# Altium schematic sheet Timer 555 _ LEVEL .SchDoc
size B; SheetNumber: 1; SheetTotal: 1; SPICEModelCacheTCHUTLJM: <root> / <DocumentId>TCHUTLJM</DocumentId> / <CacheFrame Number="0"> / <Model Name="2n3904" Kind="MDL"> / <Text>*2N3904 / *Si 310mW  40V 200mA 300MHz pkg:TO-92B 1,2,3 / .MODEL 2N3904 NPN(IS=1.4E-14 BF=300 VAF=100 IKF=0.025 ISE=3E-13 / + BR=7.5 RC=2.4 CJE=4.5E-12 TF=4E-10 CJC=3.5E-12 TR=2.1E-8 XTB=1.5 KF=9E-16 )</Text> / </Model> / </CacheFrame> / </root>
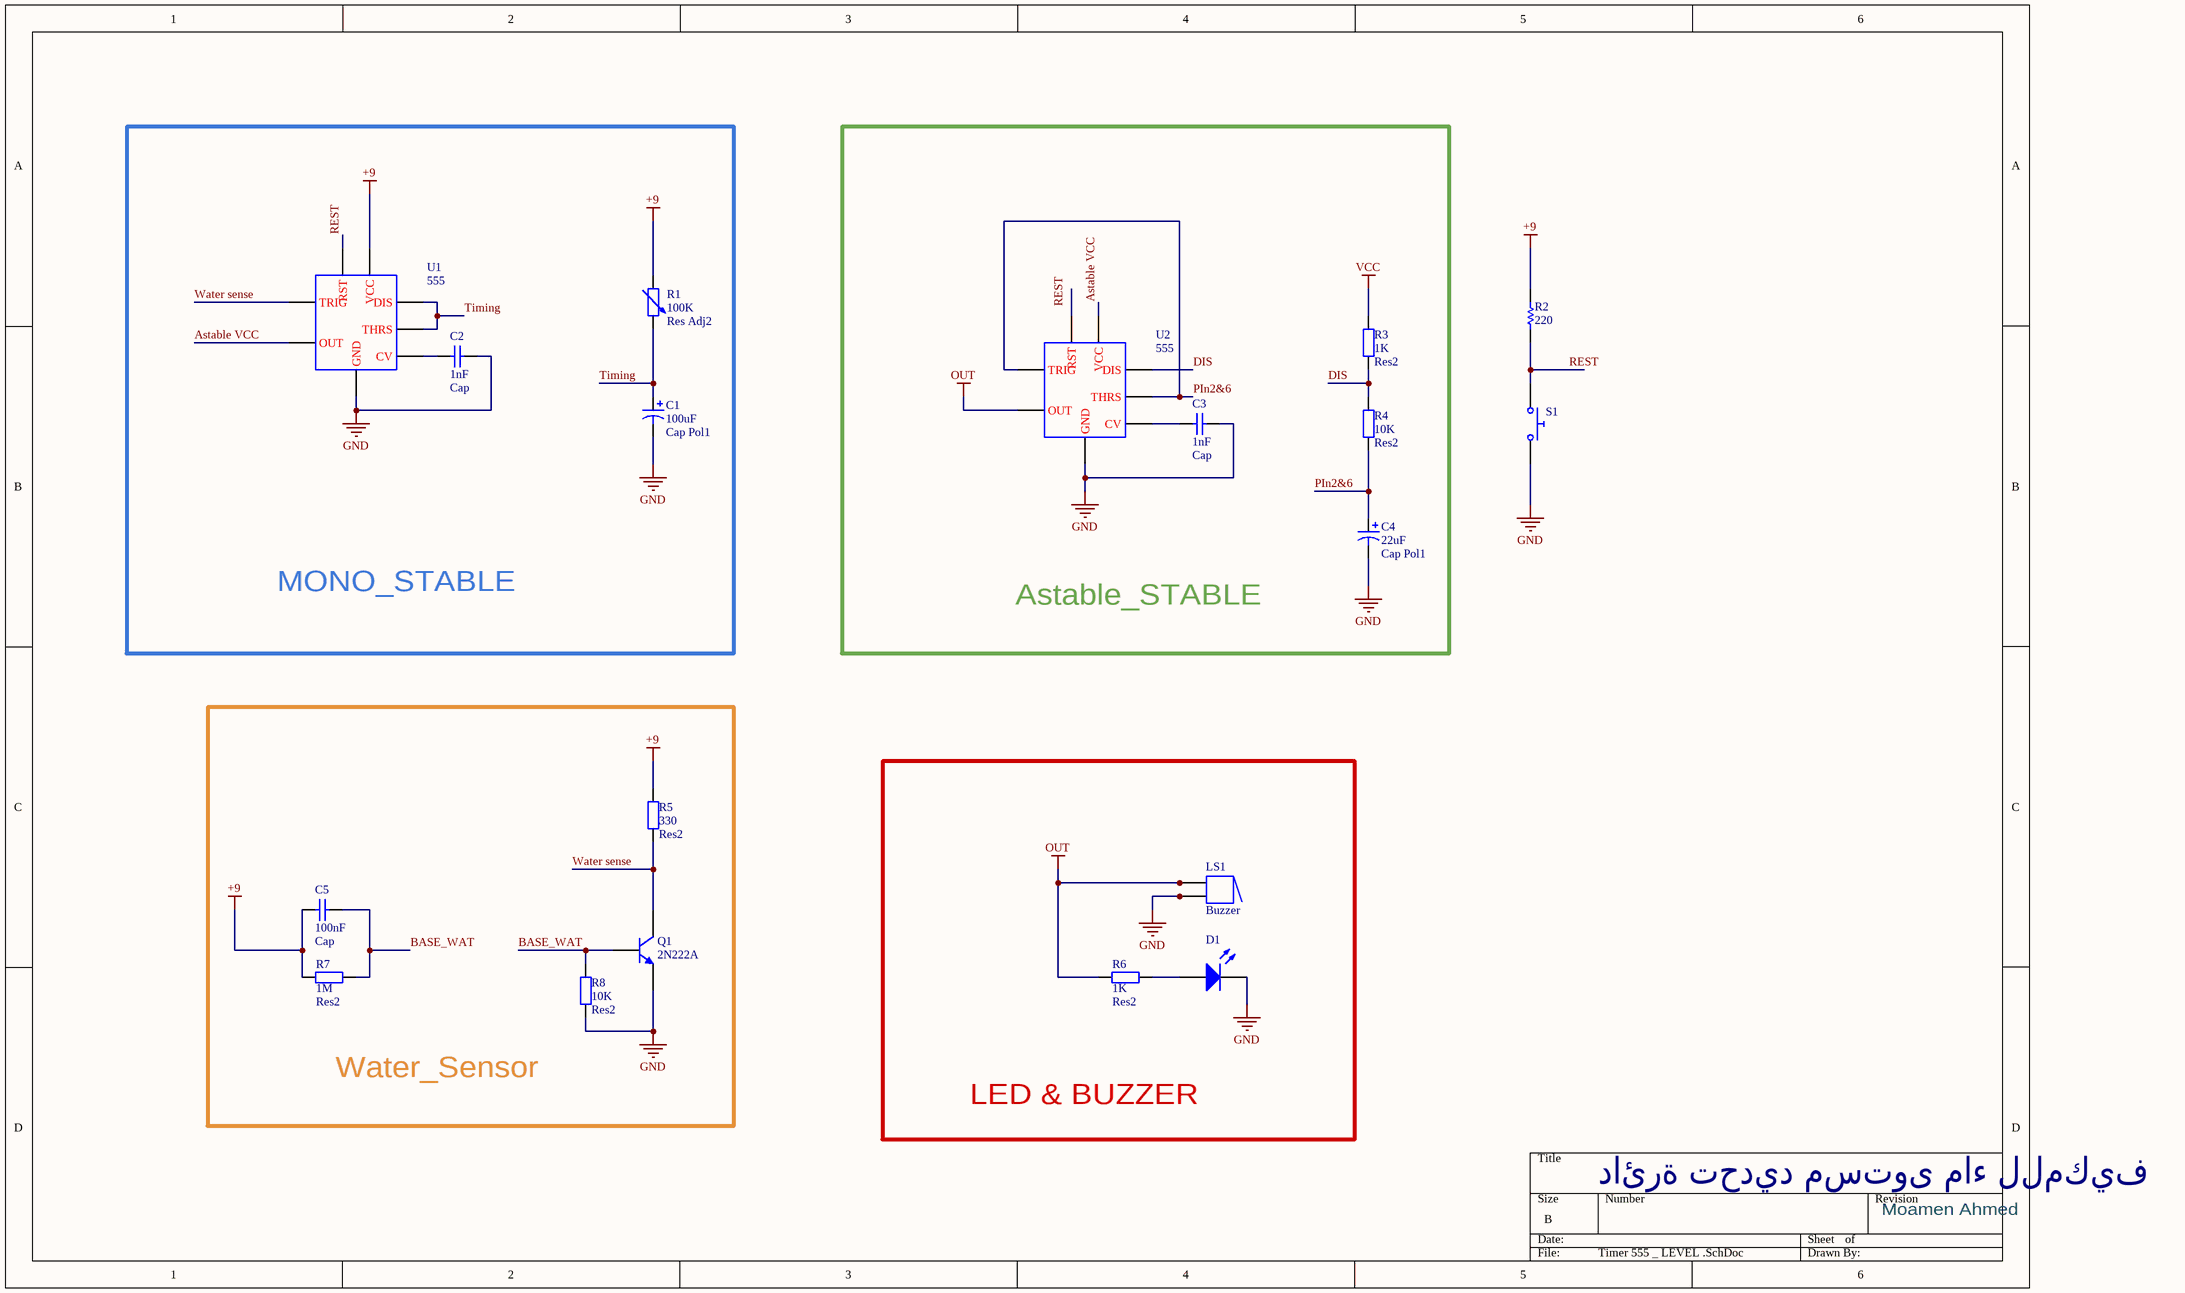
[diagram p0: Timer 555 _ LEVEL .SchDoc]

## Parts
C1  Cap Pol1  value 100uF  [RB7.6-15]
C2  Cap  value 1nF  [RAD-0.3]
C3  Cap  value 1nF  [RAD-0.3]
C4  Cap Pol1  value 22uF  [RB7.6-15]
C5  Cap  value 100nF  [RAD-0.3]
D1  Light-Emitting Diode  (value not drawn)
LS1  Buzzer  [ABSM-1574]
Q1  2N222A  [TO-92A]
R1  Res Adj2  value 100K  [AXIAL-0.6]
R2  value 220  (hidden comment: Resistor)
R3  Res2  value 1K  [AXIAL-0.4]
R4  Res2  value 10K  [AXIAL-0.4]
R5  Res2  value 330  [AXIAL-0.4]
R6  Res2  value 1K  [AXIAL-0.4]
R7  Res2  value 1M  [AXIAL-0.4]
R8  Res2  value 10K  [AXIAL-0.4]
S1  Push Button Normally Opened  (value not drawn)
U1  555
U2  555

## Blocks framed on the sheet
MONO_STABLE: C1 C2 R1 U1
Astable_STABLE: C3 C4 R3 R4 U2
Water_Sensor: C5 Q1 R5 R7 R8
LED & BUZZER: D1 LS1 R6

## Nets
+9: C5.1 R1.1 R2.2 R5.2 R7.2 U1.8(VCC)
GND: C1.2 C2.2 C3.2 C4.2 D1.2(K) LS1.2 LS1.2A Q1.1(E) R8.1 S1.2 U1.1(GND) U2.1(GND)
OUT: LS1.1 LS1.1A R6.2 U2.3(OUT)
VCC: R3.2
Astable VCC: U1.3(OUT) U2.8(VCC)
BASE_WAT: C5.2 Q1.2(B) R7.1 R8.2
DIS: R3.1 R4.2 U2.7(DIS)
PIn2&6: C4.1 R4.1 U2.2(TRIG) U2.6(THRS)
REST: R2.1 S1.1 U1.4(RST)
Timing: C1.1 R1.2 U1.6(THRS) U1.7(DIS)
Water sense: Q1.3(C) R5.1 U1.2(TRIG)
NetC2_1: C2.1 U1.5(CV)
NetC3_1: C3.1 U2.5(CV)
NetD1_1: D1.1(A) R6.1

Not connected (* = marked no-connect by the designer): U2 4(RST)

## Notes on the sheet
- دائرة تحديد مستوى ماء للمكيف
- Moamen Ahmed
- Labels drawn without touching a wire or pin: REST

## Library data of the parts
C1 C4 = Cap Pol1: Polarized Capacitor (Radial); Published: 8-Jun-2000; LatestRevisionDate: 17-Jul-2002; LatestRevisionNote: Re-released for DXP Platform.; PackageReference: RB7.6-15; Publisher: Altium Limited; PackageDescription: Polarized Capacitor (Radial); 2 Leads
C2 C3 C5 = Cap: Capacitor; Published: 8-Jun-2000; LatestRevisionDate: 17-Jul-2002; LatestRevisionNote: Re-released for DXP Platform.; PackageReference: RAD-0.3; Publisher: Altium Limited; PackageDescription: Radial Cap, Thru-Hole; 2 Leads; 0.3 in Pin Spacing
D1 = LED: AF: 1; BV: 0; BV_MAX: 1e99; EG: 1.11; FC: 0.5; IBV: 0.001; IS: 1e-14; MJSW: 0.33; NTUN: 30; TNOM: 27; XTI: 3; SimulationGenericComponent: True; CJO: 0; CJP: 0; CTA: 0; CTP: 0; FCS: 0.5; FV_MAX: 1e99; IKF: 0; IKR: 0; ISR: 1e-14; JSW: 0; JTUN: 0; JTUNSW: 0; KEG: 1; KF: 0; LEVEL: 1; N: 1; NBV: 1; NR: 1; NS: 1; PHP: 1; RS: 0; TCV: 0; TLEV: 0; TLEVC: 0; TM1: 0; TM2: 0; TPB: 0; TPHP: 0; TRS: 0; TRS2: 0; TT: 0; TTT1: 0; TTT2: 0; VJ: 1; XTITUN: 3
LS1 = Buzzer: Magnetic Transducer Buzzer; Published: 24-Mar-1999; LatestRevisionDate: 17-Dec-2003; LatestRevisionNote: Schematic revised, PCB Footprint replaced.; DatasheetVersion: 17-Dec-2003; PackageReference: ABSM-1574; Publisher: Altium Limited; PackageDescription: Magnetic Transducer Buzzer; ComponentLink1Description: Manufacturer Link; ComponentLink1URL: http://www.megastar.com/linecard/buzzmode/index.php
Q1 = 2N3904: NPN General Purpose Amplifier; Published: 8-Jun-2000; LatestRevisionDate: 15-Jan-2003; LatestRevisionNote: PCB Footprint 'BCY-W3/D4.7' replaced; DatasheetVersion: 1997; PackageVersion: Sep-1998; PackageReference: TO-92A; Publisher: Altium Limited; PackageDescription: TO, Flat Index; 3 In-Line, Axial Leads; Body Dia. 4.5mm; Leads 0.51 x 0.48 mm (max); ComponentLink1Description: Manufacturer Link; ComponentLink1URL: http://www.fairchildsemi.com/; ComponentLink2Description: Datasheet; ComponentLink2URL: http://www.fairchildsemi.com/ds/2N%2F2N3904.pdf
R1 = Res Adj2: Variable Resistor; Set Position: 0.5; Published: 8-Jun-2000; LatestRevisionDate: 17-Jul-2002; LatestRevisionNote: Re-released for DXP Platform.; PackageReference: AXIAL-0.6; Publisher: Altium Limited; PackageDescription: Axial Device, Thru-Hole; 2 Leads; 0.6 in Pin Spacing
R2 = Resistor: TC1: 0; SimulationGenericComponent: True; TC2: 0
R3-R8 = Res2: Resistor; Published: 8-Jun-2000; LatestRevisionDate: 17-Jul-2002; LatestRevisionNote: Re-released for DXP Platform.; PackageReference: AXIAL-0.4; Publisher: Altium Limited; PackageDescription: Axial Device, Thru-Hole; 2 Leads; 0.4 in Pin Spacing
S1 = Push Button NO: closed: 0; Rclosed: 1m; Ropen: 1Meg; SimulationGenericComponent: True
U1 U2 = 555: Timer 555; SimulationGenericComponent: True